# Altium project Lab1_LyaptsevIA.PrjPcb
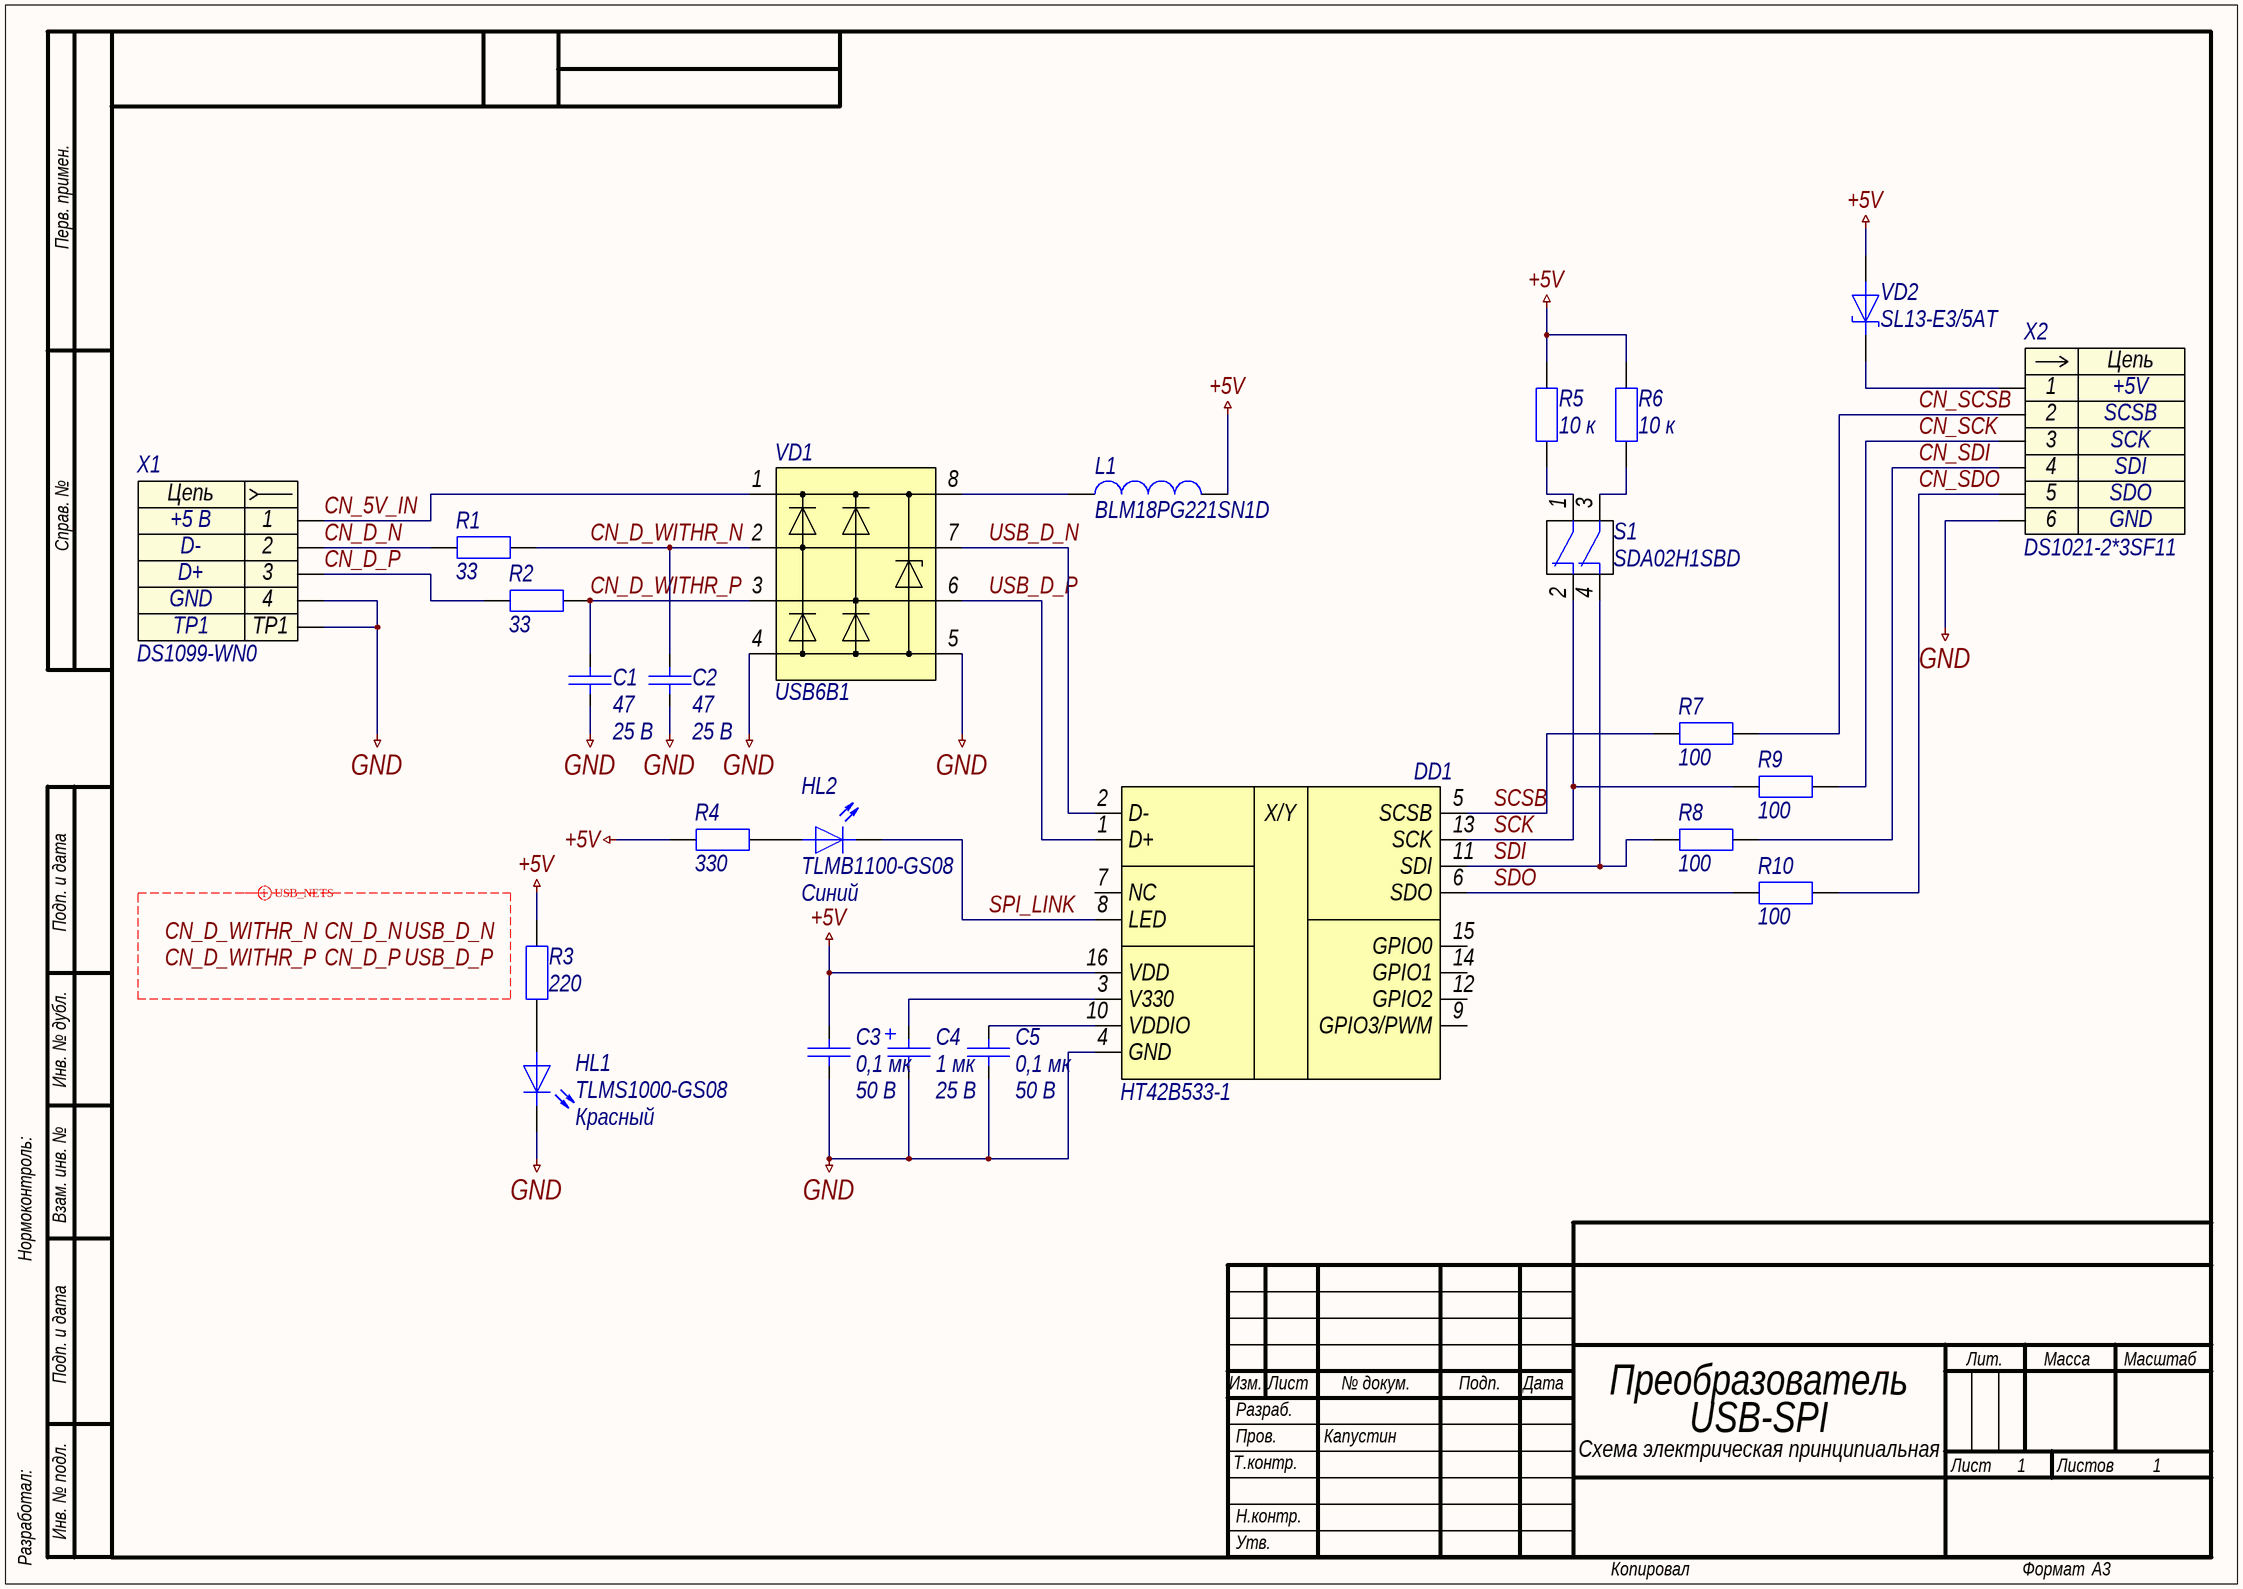
[diagram p0: Lab1_Lyaptsev_main.schdoc]
approver: Капустин; check: Капустин; designation: СПБПУ.3331506.16; developer: Ляпцев; document_code: Ý3; document_type: Схема электрическая принципиальная; pcb_dec_number: СПБПУ.3331506.16; project: Лабораторная работа №1; title: Преобразователь USB-SPI; title_line_1: Преобразователь; title_line_2: USB-SPI
1 sheet, 24 parts. Net scope: global (net labels, ports and power ports of the same name join across sheets).
Board file: Lab1_Lyaptsev_pcb.PcbDoc

## Sheet Lab1_Lyaptsev_main.schdoc: Преобразователь USB-SPI
size 420 x 297 mm; ApprovedBy: Капустин; CheckedBy: Капустин; DrawnBy: Ляпцев; DocumentNumber: СПБПУ.3331506.16Ý3; SheetNumber: 1; SheetTotal: 1; DocumentCode: Ý3; ImagePath: СПБПУ.3331506.16

### Parts
C1  47  Напряжение: 25 В  [C0201]
C2  47  Напряжение: 25 В  [C0201]
C3  0,1 мк  Напряжение: 50 В  [C0603]
C4  1 мк  Напряжение: 25 В  [C1206POLAR]
C5  0,1 мк  Напряжение: 50 В  [C0603]
DD1  HT42B533-1  [NSOP-16]
HL1  TLMS1000-GS08  Colour: Красный  [HL0603]
HL2  TLMB1100-GS08  Colour: Синий  [HL0603]
L1  BLM18PG221SN1D  [BLM-2-0603]
R1  33  [R0603]
R2  33  [R0603]
R3  220  [R0603]
R4  330  [R0603]
R5  10 к  [R0603]
R6  10 к  [R0603]
R7  100  [R0603]
R8  100  [R0603]
R9  100  [R0603]
R10  100  [R0603]
S1  SDA02H1SBD  [SDA02H1SBD]
VD1  USB6B1  [SOIC-8]
VD2  SL13-E3/5AT  [DO-214AC]
X1  DS1099-WN0  [DS1099-WN0]
X2  DS1021-2*3SF11  [DS1021-2X3SF11]

### Nets
+5V: C3.1 DD1.16(VDD) L1.2 R3.2 R4.1 R5.2 R6.2 VD2.2
GND: C1.2 C2.2 C3.2 C4.2 C5.2 DD1.4(GND) HL1.1 VD1.4 VD1.5 X1.4 X1.TP1 X2.6
CN_5V_IN: VD1.1 X1.1
CN_D_N: R1.1 X1.2
CN_D_P: R2.1 X1.3
CN_D_WITHR_N: C2.1 R1.2 VD1.2
CN_D_WITHR_P: C1.1 R2.2 VD1.3
CN_SCK: R9.2 X2.3
CN_SCSB: R7.2 X2.2
CN_SDI: R8.2 X2.4
CN_SDO: R10.2 X2.5
SCK: DD1.13(SCK) R9.1 S1.2
SCSB: DD1.5(SCSB) R7.1
SDI: DD1.11(SDI) R8.1 S1.4
SDO: DD1.6(SDO) R10.1
SPI_LINK: DD1.8(LED) HL2.1
USB_D_N: DD1.2(D-) VD1.7
USB_D_P: DD1.1(D+) VD1.6
NetC4_1: C4.1 DD1.3(V330)
NetC5_1: C5.1 DD1.10(VDDIO)
NetHL1_2: HL1.2 R3.1
NetHL2_2: HL2.2 R4.2
NetL1_1: L1.1 VD1.8
NetR5_1: R5.1 S1.1
NetR6_1: R6.1 S1.3
NetVD2_1: VD2.1 X2.1

Not connected (* = marked no-connect by the designer): DD1 7(NC) 9(GPIO3/PWM) 12(GPIO2) 14(GPIO1) 15(GPIO0)

### Layout directives
differential pair; rule Differential Pairs Routing [Pref Gap = 0.254mm    Min Gap  = 0.15mm    Max Gap  = 0.254mmPref Width = 0.381mm    Min Width  = 0.155mm    Max Width  = 0.381mm]; differential pair class USB_SIGNALS: CN_D_N, CN_D_P, CN_D_WITHR_N, CN_D_WITHR_P, USB_D_N, USB_D_P

### Notes on the sheet
- Labels drawn without touching a wire or pin: CN_D_N, CN_D_P, CN_D_WITHR_N, CN_D_WITHR_P, USB_D_N, USB_D_P
- Перв. примен.
- Справ. №
- Подп. и дата
- Инв. № дубл.
- Нормоконтроль:
- Взам. инв. №
- Изм.
- Лист
- № докум.
- Подп.
- Дата
- Лит.
- Масса
- Масштаб
- Т.контр.
- Пров.
- Разраб.
- Листов
- Разработал:
- Инв. № подл.
- Н.контр.
- Утв.
- Копировал
- Формат
- А3
- (in symbol dd0012) X/Y
- (in symbol x0003) Цепь
- (in symbol x0005) Цепь

### Library data of the parts
C1 C2 = c0003: =Описание; ID: c0003; Фамилия: Козлов; Описание: Конденсатор чип 0201 47 пФ 25 В ±5 %; Наименование: CL03C470JA3NNNC; Производитель: Samsung Electro-Mechanics; Отклонение: ±5 %; Рабочие температуры: от –55 °С до +125 °С; Температурный коэффициент емкости: C0G; Корпус: 0201; Номинал: 47; Номинальное напряжение: 25 В; HelpURL: http://product.samsungsem.com/mlcc/CL03C470JA3NNN.do
C3 C5 = c0060: =Описание; ID: c0060; Фамилия: Ларионов; Описание: Конденсатор чип 0603 100 нФ 50 В ±5 %; Наименование: CC0603JRX7R9BB104; Производитель: YAGEO Corp.; Отклонение: ±5 %; Рабочие температуры: от –55 °С до +125 °С; Температурный коэффициент емкости: X7R; Корпус: 0603; Номинал: 0,1 мк; Номинальное напряжение: 50 В; HelpURL: https://www.yageo.com/upload/media/product/productsearch/datasheet/mlcc/UPY-GPHC_X7R_6.3V-to-50V_20.pdf
C4 = c0150: =Описание; ID: c0150; Фамилия: Ларионов; Описание: Конденсатор чип 1206 1 мкФ 25 В ±10 % полярный; Наименование: 293D105X9025A2TE3; Производитель: Vishay Intertechnology, Inc.; Отклонение: ±10 %; Рабочие температуры: от –55 °С до +125 °С; Температурный коэффициент емкости: —; Корпус: 1206; Номинал: 1 мк; Номинальное напряжение: 25 В; HelpURL: https://www.vishay.com/capacitors/list/product-40002/
DD1 = dd0012: =Описание; ID: dd0012; Фамилия: Козлов; Описание: Преобразователь USB-SPI; Производитель: Holtek Semiconductor Inc.; Наименование: HT42B533-1; Корпус: NSOP-16; HelpURL: https://www.holtek.com/productdetail/-/vg/42B533-x
HL1 = hl0001: =Описание; ID: hl0001; Фамилия: Ларионов; Описание: Светодиод чип 0603 красный; Производитель: Vishay Intertechnology, Inc.; Номинальная сила света: 4 мкд; Номинальная длина волны: 628 нм; Номинальный прямой ток: 15 мА; Номинальное падение напряжения: 1,8 В; Рассеиваемая мощность: 40 мВт; Рабочие температуры: от –40 °С до +100 °С; Корпус: 0603; Наименование: TLMS1000-GS08; Цвет: Красный; HelpURL: https://www.vishay.com/leds/list/product-83172/
HL2 = hl0006: =Описание; ID: hl0006; Фамилия: Ларионов; Описание: Светодиод чип 0603 синий; Производитель: Vishay Intertechnology, Inc.; Номинальная сила света: 5 мкд; Номинальная длина волны: 466 нм; Номинальный прямой ток: 30 мА; Номинальное падение напряжения: 3,9 В; Рассеиваемая мощность: 90 мВт; Рабочие температуры: от –40 °С до +100 °С; Корпус: 0603; Примечание: Not for new design; Наименование: TLMB1100-GS08; Цвет: Синий; HelpURL: https://www.vishay.com/leds/list/product-83173/
L1 = l0002: =Описание; ID: l0002; Фамилия: Самарин; Описание: Ферритовая бусина 220 Ом ±25 %; Производитель: Murata Manufacturing Co., Ltd.; Сопротивление, 100 МГц: 220 Ом; Отклонение, 100 МГц: ±25 %; Сопротивление при постоянном токе: 0,1 Ом; Рабочие температуры: от –55 °С до +125 °С; Корпус: 0603; Наименование: BLM18PG221SN1D; HelpURL: https://www.murata.com/en-global/products/productdetail?partno=BLM18PG221SN1%23
R1 R2 = r0004: =Описание; ID: r0004; Фамилия: Козлов; Описание: Резистор чип 0603 33 Ом ±1 % 0,1 Вт; Наименование: AA0201FR-0733RL; Производитель: Yageo; Отклонение: ±1 %; Номинальное напряжение: 75 В; Рабочие температуры: от -55 °С до +155 °С; Номинальный ток: 1 А; Корпус: 0603; Номинал: 33; HelpURL: https://www.yageo.com/upload/media/product/productsearch/datasheet/rchip/PYu-AA_51_RoHS_L_3.pdf
R3 = r0005: =Описание; ID: r0005; Фамилия: Ларионов; Описание: Резистор чип 0603 220 Ом ±1 % 0,1 Вт; Наименование: RC0603FR-07220RL; Производитель: Yageo; Отклонение: ±1 %; Номинальное напряжение: 75 В; Рабочие температуры: от -55 °С до +155 °С; Номинальный ток: 1 А; Корпус: 0603; Номинал: 220; HelpURL: https://www.yageo.com/upload/media/product/productsearch/datasheet/rchip/PYu-RC_Group_51_RoHS_L_11.pdf
R4 = r0006: =Описание; ID: r0006; Фамилия: Ларионов; Описание: Резистор чип 0603 330 Ом ±1 % 0,1 Вт; Наименование: RC0603FR-07330RL; Производитель: Yageo; Отклонение: ±1 %; Номинальное напряжение: 75 В; Рабочие температуры: от -55 °С до +155 °С; Номинальный ток: 1 А; Корпус: 0603; Номинал: 330; HelpURL: https://www.yageo.com/upload/media/product/productsearch/datasheet/rchip/PYu-RC_Group_51_RoHS_L_11.pdf
R5 R6 = r0010: =Описание; ID: r0010; Фамилия: Самарин; Описание: Резистор чип 0603 10 кОм ±1 % 0,1 Вт; Наименование: RC0603FR-0710KL; Производитель: Yageo; Отклонение: ±1 %; Номинальное напряжение: 75 В; Рабочие температуры: от -55 °С до +155 °С; Номинальный ток: 1 А; Корпус: 0603; Номинал: 10 к; HelpURL: https://www.yageo.com/upload/media/product/productsearch/datasheet/rchip/PYu-RC_Group_51_RoHS_L_11.pdf
R7-R10 = r0004: =Описание; ID: r0004; Фамилия: Самарин; Описание: Резистор чип 0603 100 Ом ±1 % 0,1 Вт; Наименование: RC0603FR‍‐07100RL; Производитель: Yageo; Отклонение: ±1 %; Номинальное напряжение: 75 В; Рабочие температуры: от -55 °С до +155 °С; Номинальный ток: 1 А; Корпус: 0603; Номинал: 100; HelpURL: https://www.yageo.com/upload/media/product/productsearch/datasheet/rchip/PYu-RC_Group_51_RoHS_L_11.pdf
S1 = s0006: =Описание; ID: s0006; Фамилия: Козлов; Описание: 2-х позиционный движковый переключатель; Производитель: C&K; Ток нагрузки: 100 мА @ 5 В; Сопротивление контакта: 50 мОм; Количество контактов: 4; Рабочие температуры: от –40 °С до +85 °С; Промывка: Запрещена; Корпус: 7,06 х 9,30 х 5,45; Наименование: SDA02H1SBD; HelpURL: https://www.ckswitches.com/products/switches/product-details/DIP/SDA/SDA02H1SBD/
VD1 = vd0010: =Описание; ID: vd0010; Фамилия: Ларионов; Описание: Диодная сборка для подавления помех, от 6 В; Производитель: STMicroelectronics; Наименование: USB6B1; Корпус: SOIC-8; HelpURL: https://www.st.com/content/st_com/en/products/protection-devices/esd-protection/usb-port-protection/usb6b1.html
VD2 = vd0003: =Описание; ID: vd0003; Фамилия: Ларионов; Описание: Диод Шоттки 30 В 1,5 А; Производитель: Vishay Intertechnology, Inc.; Максимальное прямое напряжение: 0,445 В; Максимальное обратное напряжение: 30 В; Максимальный прямой ток: 1,5 А; Рабочие температуры: от –55 °С до +125 °С; Наименование: SL13-E3/5AT; Корпус: DO-214AC; HelpURL: https://www.vishay.com/product?docid=88740
X1 = x0005: =Описание; Contact_1: +5 В; Contact_2: D-; Contact_3: D+; Contact_4: GND; ID: x0005; Фамилия: Самарин; Описание: USB Type B гнездо; Производитель: Connfly Electronic Co. LTD; Наименование: DS1099-WN0; HelpURL: http://www.connfly.com/productshow.aspx?id=407
X2 = x0003: Contact_1: +5V; Contact_2: SCSB; Contact_3: SCK; Contact_4: SDI; Contact_5: SDO; Contact_6: GND; ID: x0003; Фамилия: Самарин; Описание: PLS 3x2 pin 2,54 мм прямой; Производитель: Connfly Electronic Co. LTD; Наименование: DS1021-2*3SF11; HelpURL: http://www.connfly.com/productshow.aspx?id=118